# Altium schematic sheet STM32F401.SchDoc
size A; SheetNumber: 1; SheetTotal: 3
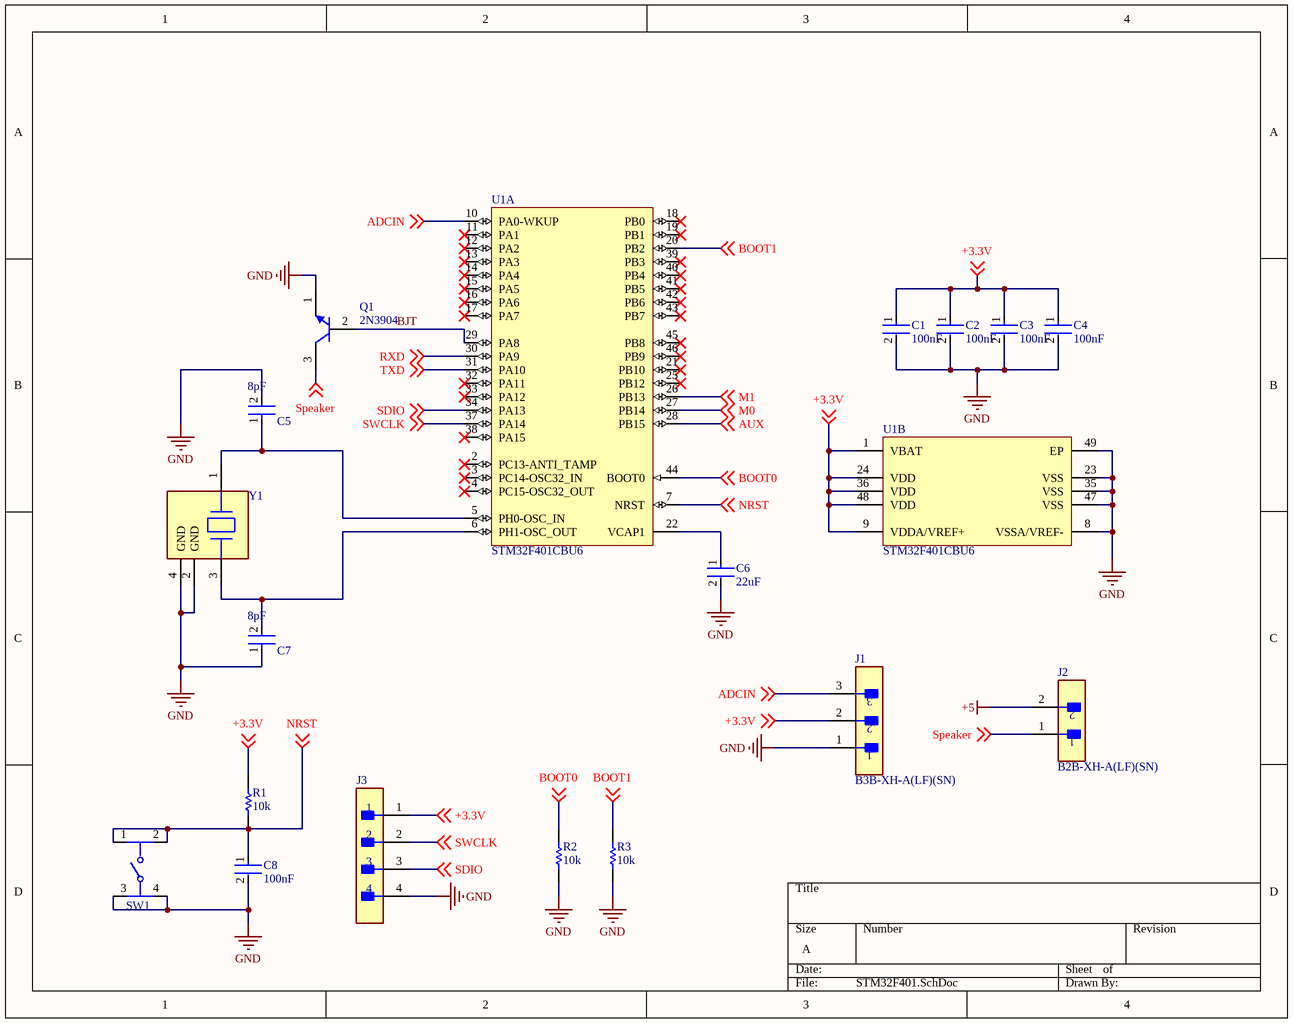
[diagram p0: STM32F401.SchDoc]

## Parts
C1  100nF  [FP-CGA3E-0_3-0_1-IPC_A]
C2  100nF  [FP-CGA3E-0_3-0_1-IPC_A]
C3  100nF  [FP-CGA3E-0_3-0_1-IPC_A]
C4  100nF  [FP-CGA3E-0_3-0_1-IPC_A]
C5  8pF  [FP-CGA3E-0_3-0_1-IPC_A]
C6  22uF  [FP-GRM188-0_2-MFG]
C7  8pF  [FP-CGA3E-0_3-0_1-IPC_A]
C8  100nF  [FP-CGA3E-0_3-0_1-IPC_A]
J1  B3B-XH-A(LF)(SN)  [FP-B3B-XH-A_LF_SN-MFG]
J2  B2B-XH-A(LF)(SN)  [FP-B2B-XH-A_LF_SN-MFG]
J3  B04B-XASK-1(LF)(SN)  [FP-B04B-XASK-1_LF_SN-MFG]  (value not drawn)
Q1  2N3904  [ONSC-TO-92-3-29-11]
R1  10k  [RESC1609X55X30LL15T15]
R2  10k  [RESC1609X55X30LL15T15]
R3  10k  [RESC1609X55X30LL15T15]
SW1  PTS645SH50SMTR92LFS  [FP-PTS645SH50SMTR92LFS-MFG]  (value not drawn)
U1  STM32F401CBU6  [STM-UFQFPN48_M]  (parts A,B of 2)
Y1  CX2016DB40000D0FLJCC  [FP-CX2016DB-MFG]  (value not drawn)

## Nets
+5: J2.2
GND: C1.2 C2.2 C3.2 C4.2 C5.2 C6.2 C7.1 C8.2 J1.1 J3.4 Q1.1(E) R2.1 R3.1 SW1.3 SW1.4 U1.8(VSSA/VREF-) U1.23(VSS) U1.35(VSS) U1.47(VSS) U1.49(EP) Y1.2(GND) Y1.4(GND)
+3.3V: C1.1 C2.1 C3.1 C4.1 J1.2 J3.1 R1.2 U1.1(VBAT) U1.9(VDDA/VREF+) U1.24(VDD) U1.36(VDD) U1.48(VDD) ; off-sheet +3.3V
ADCIN: J1.3 U1.10(PA0-WKUP) ; off-sheet ADCIN
AUX: U1.28(PB15) ; off-sheet AUX
BJT: Q1.2(B) U1.29(PA8)
BOOT0: R2.2 U1.44(BOOT0) ; off-sheet BOOT0
BOOT1: R3.2 U1.20(PB2) ; off-sheet BOOT1
M0: U1.27(PB14) ; off-sheet M0
M1: U1.26(PB13) ; off-sheet M1
NRST: C8.1 R1.1 SW1.1 SW1.2 U1.7(NRST) ; off-sheet NRST
RXD: U1.30(PA9) ; off-sheet RXD
SDIO: J3.3 U1.34(PA13) ; off-sheet SDIO
Speaker: J2.1 Q1.3(C) ; off-sheet Speaker
SWCLK: J3.2 U1.37(PA14) ; off-sheet SWCLK
TXD: U1.31(PA10) ; off-sheet TXD
NetC5_1: C5.1 U1.5(PH0-OSC_IN) Y1.1
NetC6_1: C6.1 U1.22(VCAP1)
NetC7_2: C7.2 U1.6(PH1-OSC_OUT) Y1.3

Not connected (* = marked no-connect by the designer): U1 2(PC13-ANTI_TAMP)* 3(PC14-OSC32_IN)* 4(PC15-OSC32_OUT)* 11(PA1)* 12(PA2)* 13(PA3)* 14(PA4)* 15(PA5)* 16(PA6)* 17(PA7)* 18(PB0)* 19(PB1)* 21(PB10)* 25(PB12)* 32(PA11)* 33(PA12)* 38(PA15)* 39(PB3)* 40(PB4)* 41(PB5)* 42(PB6)* 43(PB7)* 45(PB8)* 46(PB9)*

## Library data of the parts
C1-C4 C8 = CMP-2000-07546-2: Cap Ceramic 100nF 50V X7R 10% Pad SMD 0603 +125°C Automotive T/R; Weight: 7.1E-05oz; Composition: Ceramic; Max Operating Temperature: 125°C; Termination: SMD/SMT; Dielectric: X7R; Length: 1.6mm; Package Quantity: 1; REACH SVHC: No SVHC; Lead Free: Lead Free; Case Code (Metric): 1608; Min Operating Temperature: -55°C; Packaging: Tape and Reel; Tolerance: 10%; Voltage Rating: 50V; Case Code (Imperial): 0603; Capacitance: 100nF; Case/Package: 0603; Voltage Rating (DC): 50V; Depth: 0.8mm; Radiation Hardening: No; Ratings: AEC-Q200; Mount: Surface Mount; Voltage: 50V; Thickness: 0.035inch; Width: 0.8mm; Height: 0.8mm
C5 C7 = CMP-08246-000516-1: Cap Ceramic 8pF 50V C0G 0.5pF Pad SMD 0603 +125°C Automotive T/R; Length: 1.6mm; Max Operating Temperature: 125°C; Voltage Rating: 50V; Depth: 0.8mm; Height: 0.8mm; Composition: Ceramic; Package Quantity: 4000; Thickness: 0.035inch; Packaging: Tape and Reel; Weight: 7.1E-05oz; Mount: Surface Mount; Ratings: AEC-Q200; Width: 0.031inch; Voltage Rating (DC): 50V; Termination: SMD/SMT; Case Code (Metric): 1608; Case Code (Imperial): 0603; Capacitance: 8pF; Min Operating Temperature: -55°C; Dielectric: C0G; Case/Package: 0603; Radiation Hardening: No; REACH SVHC: No SVHC
C6 = CMP-2000-06337-3: Chip Multilayer Ceramic Capacitors for General Purpose, 0603, 22uF, X5R, 15%, 20%, 10V; Tolerance: 20%; Weight: 0.000222oz; Material: Ceramic; Depth: 0.8mm; Length: 1.6mm; Termination: SMD/SMT; Capacitance: 22uF; Packaging: Tape and Reel; Width: 0.8mm; Voltage Rating: 10V; Case Code (Imperial): 0603; Mount: Surface Mount; Voltage Rating (DC): 10V; Case/Package: 0603; Thickness: 0.039inch; REACH SVHC: No SVHC; Dielectric: X5R; Height: 0.8mm; Package Quantity: 4000; Case Code (Metric): 1608; Min Operating Temperature: -55°C; Lead Free: Lead Free; Max Operating Temperature: 85°C
J1 = CMP-17439-000014-3: CONN HEADER VERT 3POS 2.5MM; Max Voltage Rating (DC): 250V; Number of Positions: 3; Current Rating: 3A; Gender: Male; Wire/Cable Gauge: 22AWG; Contact Resistance: 20mR; Insulation Resistance: 1GR; Insulation Material: Nylon; Contact Plating: Tin; Depth: 5.75mm; Contact Type: Male Pin; Max Operating Temperature: 85°C; Insulation Color: Natural; Voltage Rating (AC): 250V; Color: Natural; Connector Type: Header; Orientation: Straight; Fastening Type: Detent; Housing Color: White; Min Operating Temperature: -25°C; Termination: Solder; Voltage Rating: 250V; Series: XH; Pitch: 2.5mm; Contact Shape: Square; Number of Rows: 1; Lead Free: Lead Free; Packaging: Bulk; Mount: Through Hole; Flammability Rating: UL94 V-0; Max Voltage Rating (AC): 250V; REACH SVHC: No SVHC; Housing Material: Polyamide; Contact Material: Brass; Lead Pitch: 2.5mm; Contact Finish - Mating: TIN; Length: 9.9mm; Max Current Rating: 3A; Number of Contacts: 3
J2 = CMP-2000-05888-3: CONN HEADER VERT 2POS 2.5MM; Current Rating: 3A; Voltage Rating: 250V; Number of Contacts: 2; Contact Resistance: 20mR; Wire/Cable Gauge: 22AWG; Insulation Resistance: 1GR; Connector Type: Male Pin; Packaging: Bulk; Contact Material: Brass; Lead Free: Lead Free; Orientation: Straight; Contact Plating: Tin; Max Current Rating: 3A; Termination: Solder; Fastening Type: Detent; Depth: 5.75mm; Housing Material: Polyamide; REACH SVHC: No SVHC; Series: XH; Voltage Rating (AC): 250V; Number of Positions: 2; Color: Natural; Contact Type: Male Pin; Max Voltage Rating (DC): 250V; Pitch: 2.5mm; Lead Pitch: 2.5mm; Mount: Through Hole; Max Operating Temperature: 85°C; Length: 7.4mm; Max Voltage Rating (AC): 250V; Min Operating Temperature: -25°C; Number of Rows: 1; Housing Color: White
J3 = CMP-17439-000018-1: CONN HEADER VERT 4POS 2.5MM; Manufacturer: JST; Current Rating: 3A; Voltage Rating: 250V; Conn Orientation: Straight; Conn Gender: Male; Number Of Contacts: 4; ComponentLink2Description: Datasheet; Package: B04B-XASK-1(LF)(SN); Octopart: https://octopart.com/b04b-xask-1%28lf%29%28sn%29-jst-3990149; Pitch: 2.5mm; Device Class L1: Connectors; RoHS: TRUE; Device Class L3: unset; Manufacturer Part Number: B04B-XASK-1(LF)(SN); Temperature Range High: +85°C; Height: 8.8mm; Lead Free: Yes; Category: Conn; Temperature: -25°C to +85°C; Digikey Description: CONN HEADER VERT 4POS 2.5MM; Temperature Range Low: -25°C; ComponentLink2URL: http://www.jst-mfg.com/product/pdf/eng/eXA1.pdf; Contact Material: Tin,Copper; Device Class L2: Headers and Wire Housings; Automotive: No; Number Of Rows: 1
Q1 = CMP-2000-05562-1: General Purpose Transistor, NPN Silicon, 200 mA, 60 V, -55 to 150 degC, 3-Pin TO-92, RoHS, Bulk; Manufacturer: ONSemiconductor; Emitter- Base Voltage VEBO: 6V; Maximum Power Dissipation: 625mW; Maximum DC Collector Current: 0.2A; Collector- Emitter Voltage VCEO Max: 40V; Collector- Base Voltage VCBO: 60V; DC Collector/Base Gain hfe Min: 60; Configuration: Single; Collector-Emitter Saturation Voltage: 0.3V; Gain Bandwidth Product fT: 270MHz; Mounting Style: ThroughHole; Package / Case: TO-92-3(TO-226); Mounting Technology: ThroughHole; Minimum Operating Temperature: -65C; Datasheet Version: Rev. 8, 08/2012; Product Category: BipolarTransistors-BJT; Factory Pack Quantity: 5000; Transistor Polarity: NPN; Package Description: 3-Pin Transistor Outline, Body 4.825 x 3.685 mm, Pitch 1.27 mm; RoHS: Details; Datasheet URL: https://datasheet.ciiva.com/4725/2n3903-d-285841-4725808.pdf; Packaging: Bulk; Maximum Operating Temperature: +150C; Package Reference: TO-92-3-29-11; Brand: ONSemiconductor; Manufacturer URL: http://www.onsemi.com/
R1-R3 = CMP-1012-00623-3: Chip Resistor, 10 KOhm, +/- 1%, 0.1 W, -55 to 155 degC, 0603 (1608 Metric), RoHS, Tape and Reel; Manufacturer: Panasonic; Voltage Rating: 75V; Case\/Package: 0603; Power Rating: 100mW; Resistance: 10KOhm; Temperature Coefficient: 100ppm\/degreesC; Number of Pins: 2; Package Reference: 603; Depth: 0.8mm; Mount: SurfaceMount; Package Description: 2-Pin Surface Mount Device, Body 1.6 x 0.85 mm; Datasheet Version: 02/2017; Length: 1.6mm; Lead Free: LeadFree; Height: 0.45mm; Number of Terminations: 2; Max Power Dissipation: 100mW; Min Operating Temperature: -55degC; Datasheet URL: https://industrial.panasonic.com/cdbs/www-data/pdf/RDA0000/AOA0000C304.pdf; Termination: SMD/SMT; Case Code (Metric): 1608; Case Code (Imperial): 0603; Tolerance: 1%; Max Operating Temperature: 155degC; RoHSCompliant: true; Voltage Rating (DC): 75V; Radiation Hardening: No; Packaging: TapeandReel; Composition: ThickFilm; Mounting Technology: SurfaceMount; Manufacturer URL: http://www.panasonic.com/; Width: 0.031inch; REACH SVHC: NoSVHC; Contact Plating: Tin; Military Standard: Not; Package Quantity: 1
SW1 = CMP-10040-000028-1: SWITCH TACTILE SPST-NO 0.05A 12V; Operating Force: 200gf; Current Rating: 50mA; Illumination Type: Non-Illuminated; Actuator Material: Nylon; Throw Configuration: SPST; Switch Function: Off-Mom; Mechanical Life: 100000Cycles; Actuator Type: Standard; Packaging: Tape and Reel; Termination: Gull Wing; Max Operating Temperature: 60°C; Length: 6mm; REACH SVHC: No SVHC; Orientation: Straight; Max Voltage Rating (DC): 12V; Package Quantity: 1000; Max Current Rating: 50mA; Mount: Surface Mount; Contact Material: Bronze; Case/Package: SMD/SMT; Lead Free: Lead Free; Min Operating Temperature: -20°C; Contact Plating: Silver; Color: Black; Depth: 9mm; Voltage Rating (DC): 12V
U1 = CMP-0243-00118-2: ARM Cortex-M4 32-bit MCU+FPU, 105 DMIPS, 128 kB Flash, 64 kB Internal RAM, 36 I/Os, 48-pin UFQFPN, -40 to 85 degC, Tray; Manufacturer: STMicroelectronics; Internal RAM Size (kB): 64; I/Os (High Current): 36; Operating Frequency(F) (Processor speed) (MHz): 84; Supply Voltage(Vcc) min (V): 1.8; FLASH Size (Prog) (kB): 128; Supply Voltage(Vcc) max (V): 3.6; PackageDescription: 48-Pin Ultra Thin Fine Pitch Quad Flat No-Lead, 7 x 7 x 0.6 mm Body, 0.5 mm Pitch, Exposed Pad; Mounting Technology: Surface Mount; PartNumber: STM32F401CBU6; ComponentLink1Description: Manufacturer URL; ComponentLink1URL: http://www.st.com/web/en/home.html; Core: ARM Cortex-M4; ComponentLink2URL: http://www.st.com/st-web-ui/static/active/en/resource/technical/document/data_brief/DM00071938.pdf; ComponentLink3Description: Package Specification; DatasheetVersion: Rev. 1; PackageReference: UFQFPN48; Packing: Tray; PackageVersion: Rev. 1, 04/2013; ComponentLink3URL: http://www.st.com/st-web-ui/static/active/en/resource/technical/document/data_brief/DM00071938.pdf; ComponentLink2Description: Datasheet
Y1 = CMP-20727-000002-1: CRYSTAL 40.0000MHZ 8PF SMD; Manufacturer: Kyocera International Inc. Electronic Components; Esr: 50Ω; Tolerance: 15ppm; Frequency: 40MHz; Series: CX2016DB; RoHS: TRUE; Temperature Range High: +85°C; Height: 0.45mm; Manufacturer Part Number: CX2016DB40000D0FLJCC; ComponentLink2Description: Datasheet; Load Capacitance: 8pF; ComponentLink2URL: https://global.kyocera.com/prdct/electro/product/pdf/cx2016db_e.pdf; Temperature: -30°C to +85°C; Device Class L2: Crystals / Oscillators; Category: Crys; Mouser Description: Crystal 40MHz 8pF 4-Pin SMD T/R; Lead Free: Yes; Device Class L3: Crystals; Temperature Range Low: -30°C; Octopart: https://octopart.com/cx2016db40000d0fljcc-avx+%2F+kyocera-71139660; Device Class L1: Passive Components; Automotive: No; Digikey Description: CRYSTAL 40.0000MHZ 8PF SMD; Package: CX2016DB; Stability: 15ppm